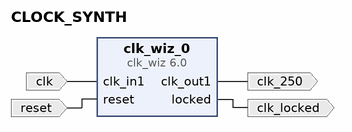
[diagram p0: block diagram of the top level]
# Vivado block design CLOCK_SYNTH, xc7s25csga225-1, Vivado 2024.1.2
create_bd_design CLOCK_SYNTH

create_bd_port -dir I -type clk clk
set_property -dict {CONFIG.FREQ_HZ 12000000} [get_bd_ports clk]
create_bd_port -dir O -type clk clk_250
create_bd_port -dir I -type rst reset
set_property -dict {CONFIG.POLARITY ACTIVE_HIGH} [get_bd_ports reset]
create_bd_port -dir O clk_locked

create_bd_cell -type ip -vlnv xilinx.com:ip:clk_wiz:6.0 clk_wiz_0
set_property -dict [list \
  CONFIG.CLKIN1_JITTER_PS 833.33 \
  CONFIG.CLKOUT1_JITTER 430.512 \
  CONFIG.CLKOUT1_PHASE_ERROR 668.310 \
  CONFIG.CLKOUT1_REQUESTED_OUT_FREQ 250 \
  CONFIG.CLKOUT2_JITTER 508.404 \
  CONFIG.CLKOUT2_PHASE_ERROR 630.285 \
  CONFIG.CLKOUT2_USED false \
  CONFIG.MMCM_CLKFBOUT_MULT_F 62.500 \
  CONFIG.MMCM_CLKIN1_PERIOD 83.333 \
  CONFIG.MMCM_CLKIN2_PERIOD 10.0 \
  CONFIG.MMCM_CLKOUT0_DIVIDE_F 3.000 \
  CONFIG.MMCM_CLKOUT1_DIVIDE 1 \
  CONFIG.NUM_OUT_CLKS 1 \
  CONFIG.PRIM_IN_FREQ 12 \
  CONFIG.RESET_BOARD_INTERFACE reset \
  CONFIG.USE_BOARD_FLOW true \
] [get_bd_cells clk_wiz_0]

# ---- connections ----

connect_bd_net [get_bd_ports clk] [get_bd_pins clk_wiz_0/clk_in1]
connect_bd_net [get_bd_pins clk_wiz_0/clk_out1] [get_bd_ports clk_250]
connect_bd_net [get_bd_pins clk_wiz_0/locked] [get_bd_ports clk_locked]
connect_bd_net [get_bd_ports reset] [get_bd_pins clk_wiz_0/reset]

validate_bd_design
save_bd_design
